# EAGLE schematic PD-adder (EAGLE 9.6.2)
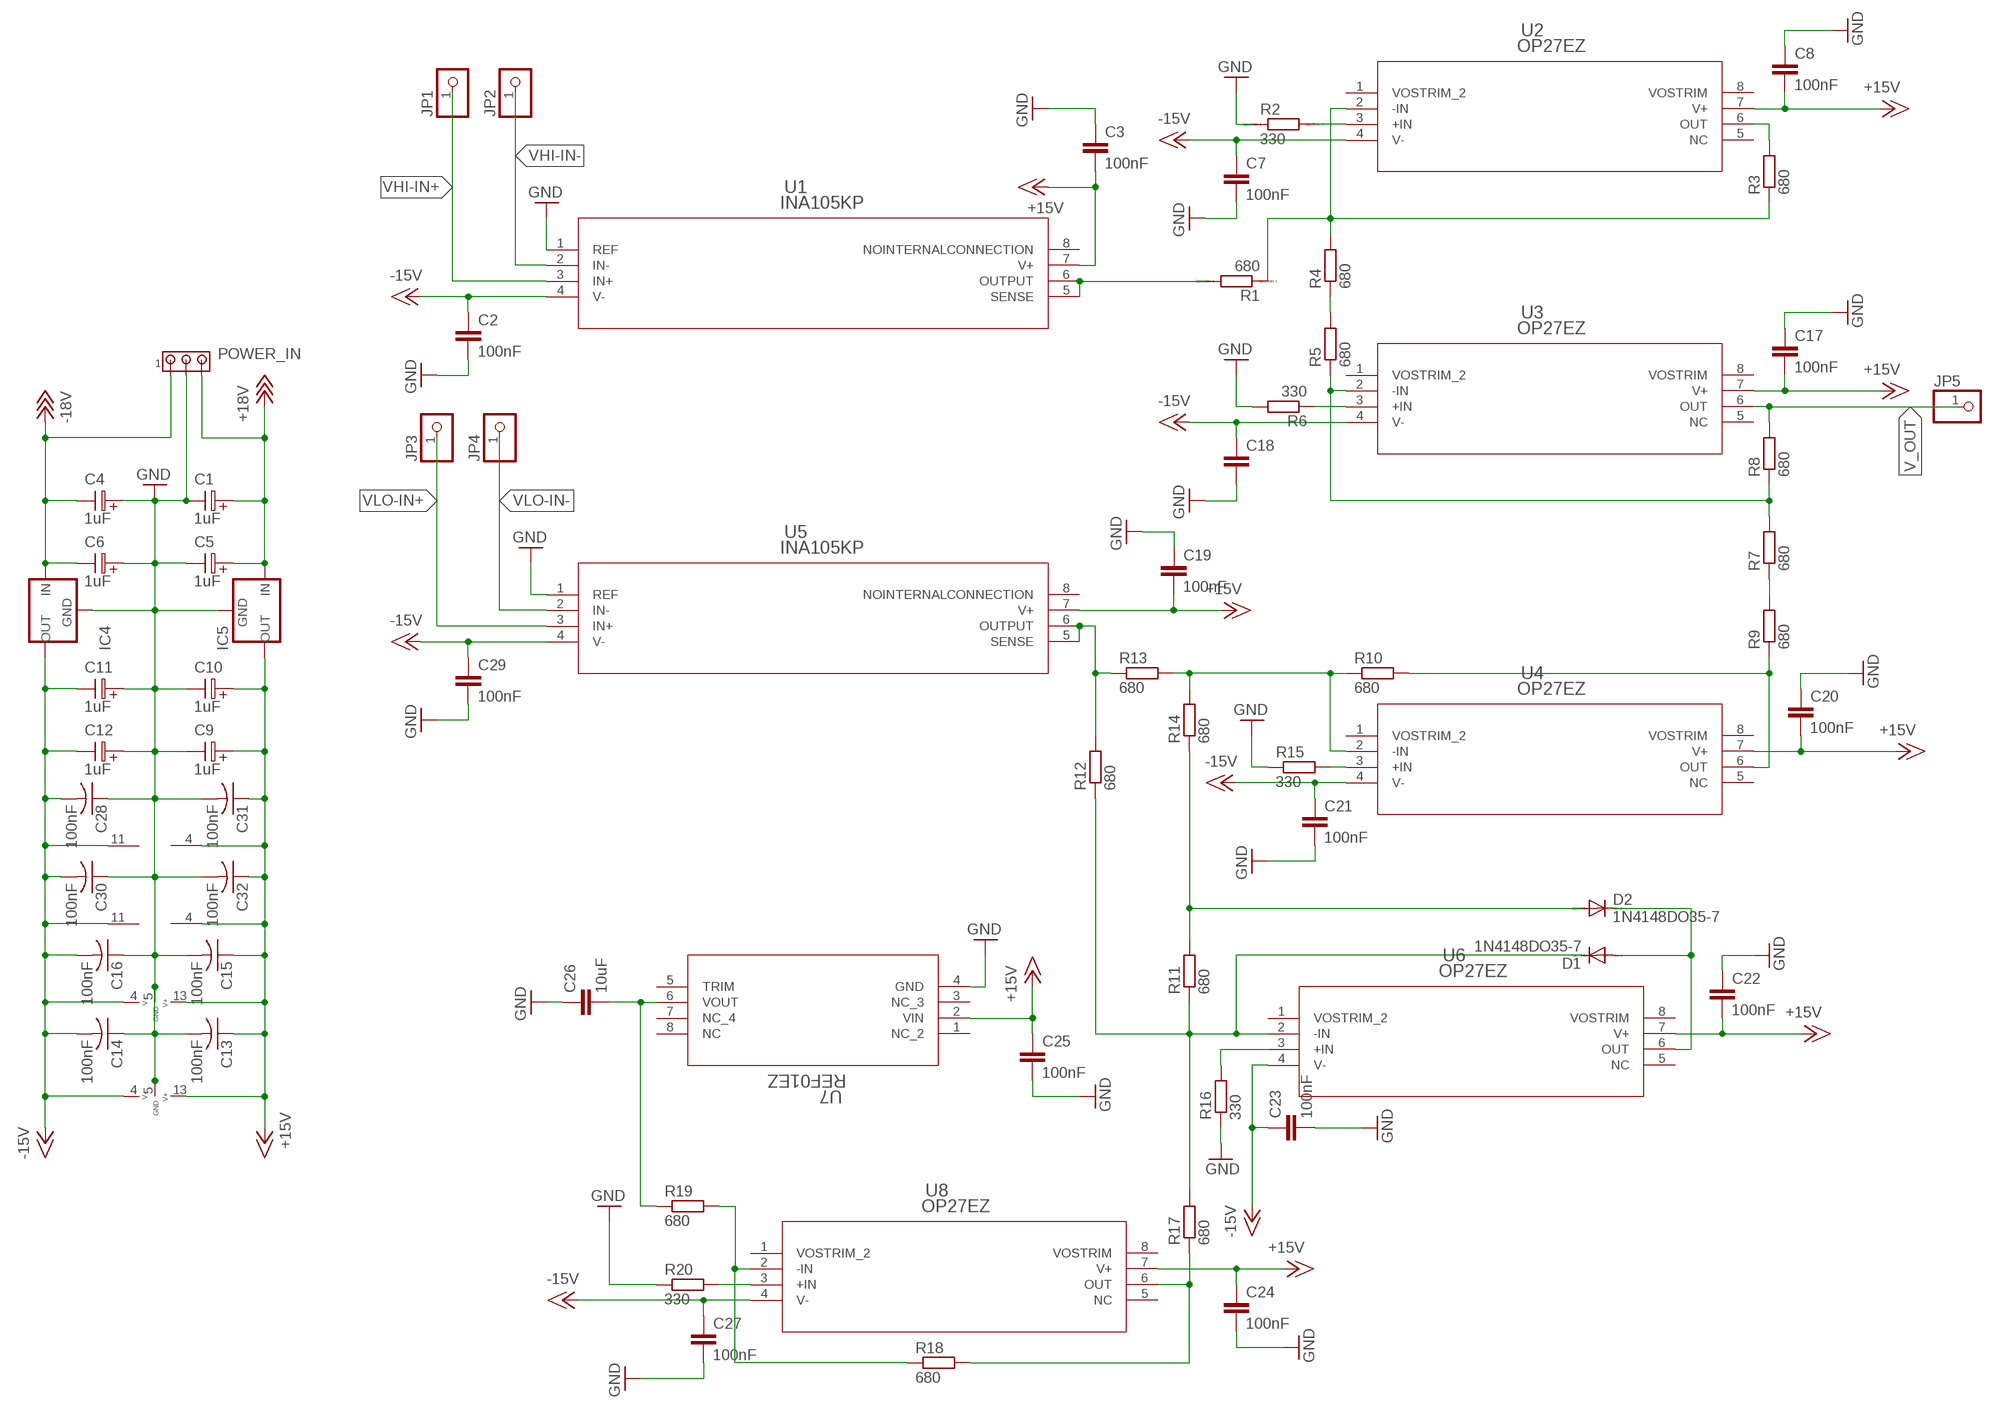
[diagram p0: schematic, sheet 1]

## Parts
C1  1uF  ELC-2,5  [ES-2,5]
C2  100nF  C-EUC1206  [C1206@1]
C3  100nF  C-EUC1206  [C1206@1]
C4  1uF  ELC-2,5  [ES-2,5]
C5  1uF  ELC-2,5  [ES-2,5]
C6  1uF  ELC-2,5  [ES-2,5]
C7  100nF  C-EUC1206  [C1206@1]
C8  100nF  C-EUC1206  [C1206@1]
C9  1uF  ELC-2,5  [ES-2,5]
C10  1uF  ELC-2,5  [ES-2,5]
C11  1uF  ELC-2,5  [ES-2,5]
C12  1uF  ELC-2,5  [ES-2,5]
C13  100nF  C-USC0805  [C0805]
C14  100nF  C-USC0805  [C0805]
C15  100nF  C-USC0805  [C0805]
C16  100nF  C-USC0805  [C0805]
C17  100nF  C-EUC1206  [C1206@1]
C18  C-EUC1206  [C1206@1]
C19  100nF  C-EUC1206  [C1206@1]
C20  100nF  C-EUC1206  [C1206@1]
C21  100nF  C-EUC1206  [C1206@1]
C22  100nF  C-EUC1206  [C1206@1]
C23  100nF  C-EUC1206  [C1206@1]
C24  100nF  C-EUC1206  [C1206@1]
C25  100nF  C-EUC1206  [C1206@1]
C26  10uF  C-EUC1206  [C1206@1]
C27  100nF  C-EUC1206  [C1206@1]
C28  100nF  C-USC0805  [C0805]
C29  100nF  C-EUC1206  [C1206@1]
C30  100nF  C-USC0805  [C0805]
C31  100nF  C-USC0805  [C0805]
C32  100nF  C-USC0805  [C0805]
D1  1N4148DO35-7  [DO35-7]
D2  1N4148DO35-7  [DO35-7]
IC1  ADG221KN  [DIL16]
IC4  79XXL  [79XXL]
IC5  78XXL  [78XXL]
IC6  LF347N  [DIL14]
IC7  LF347N  [DIL14]
IC8  ADG222KN  [DIL16]
JP1  PINHD-1X1  [1X01]
JP2  PINHD-1X1  [1X01]
JP3  PINHD-1X1  [1X01]
JP4  PINHD-1X1  [1X01]
JP5  PINHD-1X1  [1X01]
POWER_IN  MTA03-100  [10X03MTA]
R1  680  R  [R0805]
R2  330  R  [R0805]
R3  680  R-EU_M0805  [M0805]
R4  680  R-EU_M0805  [M0805]
R5  680  R-EU_M0805  [M0805]
R6  330  R-EU_M0805  [M0805]
R7  680  R-EU_M0805  [M0805]
R8  680  R-EU_M0805  [M0805]
R9  680  R-EU_M0805  [M0805]
R10  680  R-EU_R0805  [R0805]
R11  680  R-EU_R0805  [R0805]
R12  680  R-EU_R0805  [R0805]
R13  680  R-EU_R0805  [R0805]
R14  680  R-EU_R0805  [R0805]
R15  330  R-EU_R0805  [R0805]
R16  330  R-EU_M0805  [M0805]
R17  680  R-EU_M0805  [M0805]
R18  680  R-EU_M0805  [M0805]
R19  680  R-EU_M0805  [M0805]
R20  330  R-EU_M0805  [M0805]
U1  INA105KP  [P8]
U2  OP27EZ  [Q_8_ADI]
U3  OP27EZ  [Q_8_ADI]
U4  OP27EZ  [Q_8_ADI]
U5  INA105KP  [P8]
U6  OP27EZ  [Q_8_ADI]
U7  REF01EZ  [Q_8_ADI]
U8  OP27EZ  [Q_8_ADI]

## Nets
+15V: C3.2 C8.2 C9.1 C10.1 C13.1 C15.1 C17.2 C19.2 C20.2 C22.2 C24.1 C25.1 C31.1 C32.1 IC1.13(P:V+) IC5.OUT IC6.4(P:V+) IC7.4(P:V+) IC8.13(P:V+) U1.7(V+) U2.7(V+) U3.7(V+) U4.7(V+) U5.7(V+) U6.7(V+) U7.2(VIN) U8.7(V+)
+18V [+18V]: C1.1 C5.1 IC5.IN POWER_IN.3
-15V: C2.1 C7.1 C11.2 C12.2 C14.2 C16.2 C18.1 C21.1 C23.1 C27.1 C28.2 C29.1 C30.2 IC1.4(P:V-) IC4.OUT IC6.11(P:V-) IC7.11(P:V-) IC8.4(P:V-) U1.4(V-) U2.4(V-) U3.4(V-) U4.4(V-) U5.4(V-) U6.4(V-) U8.4(V-)
-18V [-18V]: C4.2 C6.2 IC4.IN POWER_IN.1
GND: C1.2 C2.2 C3.1 C4.1 C5.2 C6.1 C7.2 C8.1 C9.2 C10.2 C11.1 C12.1 C15.2 C16.1 C17.1 C18.2 C19.1 C20.1 C21.2 C22.1 C23.2 C24.2 C25.2 C26.1 C27.2 C28.1 C29.2 C30.1 C31.2 C32.2 IC4.GND IC5.GND IC8.5(P:GND) POWER_IN.2 R2.1 R6.2 R15.1 R16.1 R20.1 U1.1(REF) U5.1(REF) U7.4(GND)
N$1: C13.2 C14.1 IC1.5(P:GND)
N$2: R2.2 U2.3(+IN)
N$3: R3.2 U2.6(OUT)
N$4: R4.1 R5.2
N$5: R5.1 R7.2 R8.1 U3.2(-IN)
N$6: R7.1 R9.2
N$7: R9.1 R10.2 U4.6(OUT)
N$8: R10.1 R13.2 R14.2 U4.2(-IN)
N$9: R15.2 U4.3(+IN)
N$10: D2.A R11.2 R14.1
N$11: R12.2 R13.1 U5.5(SENSE) U5.6(OUTPUT)
N$12: D1.C R11.1 R12.1 R17.2 U6.2(-IN)
N$13: R16.2 U6.3(+IN)
N$14: R20.2 U8.3(+IN)
N$15: R1.1 R3.1 R4.2 U2.2(-IN)
N$16: R6.1 U3.3(+IN)
N$17: R17.1 R18.2 U8.6(OUT)
N$18: D1.A D2.C U6.6(OUT)
N$20: R18.1 R19.2 U8.2(-IN)
N$21: C26.2 R19.1 U7.6(VOUT)
V_OUT: JP5.1 R8.2 U3.6(OUT)
VHI-IN+: JP1.1 U1.3(IN+)
VHI-IN-: JP2.1 U1.2(IN-)
VLO-IN+: JP3.1 U5.3(IN+)
VLO-IN-: JP4.1 U5.2(IN-)
VOUT: R1.2 U1.5(SENSE) U1.6(OUTPUT)
Unconnected: IC1.1(A:IN) IC1.2(A:D) IC1.3(A:S) IC1.6(D:S) IC1.7(D:D) IC1.8(D:IN) IC1.9(C:IN) IC1.10(C:D) IC1.11(C:S) IC1.12(\WR:!WR) IC1.14(B:S) IC1.15(B:D) IC1.16(B:IN) IC6.1(A:OUT) IC6.2(A:-IN) IC6.3(A:+IN) IC6.5(B:+IN) IC6.6(B:-IN) IC6.7(B:OUT) IC6.8(C:OUT) IC6.9(C:-IN) IC6.10(C:+IN) IC6.12(D:+IN) IC6.13(D:-IN) IC6.14(D:OUT) IC7.1(A:OUT) IC7.2(A:-IN) IC7.3(A:+IN) IC7.5(B:+IN) IC7.6(B:-IN) IC7.7(B:OUT) IC7.8(C:OUT) IC7.9(C:-IN) IC7.10(C:+IN) IC7.12(D:+IN) IC7.13(D:-IN) IC7.14(D:OUT) IC8.1(A:IN) IC8.2(A:D) IC8.3(A:S) IC8.6(D:S) IC8.7(D:D) IC8.8(D:IN) IC8.9(C:IN) IC8.10(C:D) IC8.11(C:S) IC8.12(\WR:!WR) IC8.14(B:S) IC8.15(B:D) IC8.16(B:IN) U1.8(NOINTERNALCONNECTION) U2.1(VOSTRIM_2) U2.5(NC) U2.8(VOSTRIM) U3.1(VOSTRIM_2) U3.5(NC) U3.8(VOSTRIM) U4.1(VOSTRIM_2) U4.5(NC) U4.8(VOSTRIM) U5.8(NOINTERNALCONNECTION) U6.1(VOSTRIM_2) U6.5(NC) U6.8(VOSTRIM) U7.1(NC_2) U7.3(NC_3) U7.5(TRIM) U7.7(NC_4) U7.8(NC) U8.1(VOSTRIM_2) U8.5(NC) U8.8(VOSTRIM)

## Library data of the parts
C1 C4-C6 C9-C12 = discrete:ELC-2,5
C2 C3 C7 C8 C17-C27 C29 = rcl:C-EU: CAPACITOR, European symbol
C13-C16 C28 C30-C32 = rcl:C-US: CAPACITOR, American symbol
D1 D2 = diode:1N4148: DIODE high speed (Philips)
IC1 = linear:ADG221K: CMOS SWITCH
IC4 = v-reg:79XXL: VOLTAGE REGULATOR
IC5 = v-reg:78XXL: VOLTAGE REGULATOR
IC6 IC7 = linear:LF347: OP AMP
IC8 = linear:ADG222K: CMOS SWITCH
JP1-JP5 = pinhead:PINHD-1X1: PIN HEADER
POWER_IN = con-amp:MTA03-100: AMP connector
R1 R2 = eagle-ltspice:R: RESISTOR, European symbol; SPICEMODEL: NONE; SPICEPREFIX: R
R3-R20 = rcl:R-EU_: RESISTOR, European symbol
U1 U5 = INA105KP:INA105KP; COPYRIGHT: Copyright (C) 2021 Ultra Librarian. All rights reserved.; MANUFACTURER_PART_NUMBER: INA105KP; MFR_NAME: Texas Instruments
U2-U4 U6 U8 = OP27EPZ:OP27EZ; COPYRIGHT: Copyright (C) 2021 Ultra Librarian. All rights reserved.; MANUFACTURER_PART_NUMBER: OP27EZ; MFR_NAME: Analog Devices Inc
U7 = REF01EZ:REF01EZ; COPYRIGHT: Copyright (C) 2021 Ultra Librarian. All rights reserved.; MANUFACTURER_PART_NUMBER: REF01EZ; MFR_NAME: Analog Devices Inc

## Net classes
1 GND: width 0.406 mm, drill 0.61 mm, clearance 0.178 mm
2 +15V: width 0.406 mm, drill 0.61 mm, clearance 0.178 mm
3 -15V: width 0.406 mm, drill 0.61 mm, clearance 0.178 mm
4 +18V: width 0.406 mm, drill 0.61 mm, clearance 0.178 mm
5 -18V: width 0.406 mm, drill 0.61 mm, clearance 0.61 mm